# Altium project Yukitora.PrjPcb (part 1 of 2)
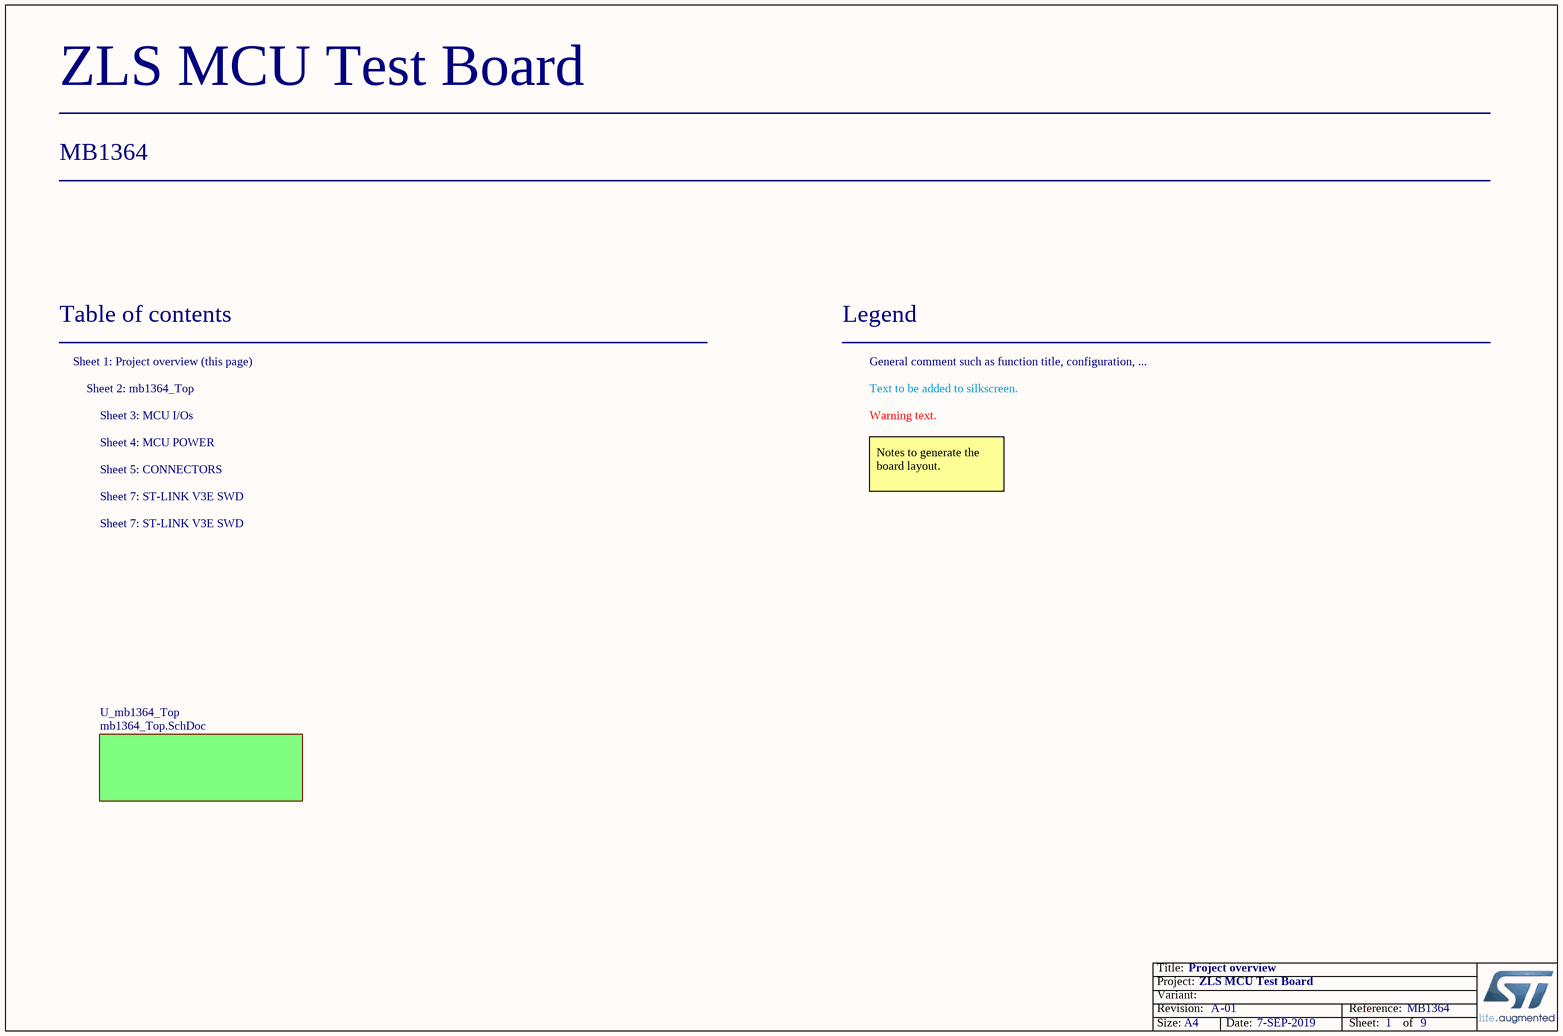
[diagram p0: Project_Overview.SchDoc]
Board_Assembly_Revision: 01; Board_Document_Date: 7-SEP-2019; Board_Name: ZLS MCU Test Board; Board_PCB_Revision: A; Board_Reference: MB1364
7 sheets, 64 parts. Net scope: flat (ports and power ports of the same name join across sheets).
Board file: MB1364.PcbDoc
Sheets:
  Project_Overview.SchDoc
    U_mb1364_Top = MB1364_Top.SchDoc
      U_Connectors = Connectors.SchDoc
      U_Power_Board = Power_Board.SchDoc
      U_MCU_144_IOs = MCU_144_IOs.SchDoc
      U_MCU_144_POWER = MCU_144_POWER.SchDoc
      U_ST_LINK_V3E = ST_LINK_V3E.SchDoc

## Sheet Project_Overview.SchDoc: Project overview
size A4; Date: Not used; ApprovedBy: Not used; CheckedBy: Not used; Author: Not used; CompanyName: STMicroelectronics; DrawnBy: Not used; Engineer: Not used; Organization: Not used; Address1: Not used; Address2: Not used; Address3: Not used; Address4: Not used; DocumentNumber: 1; Revision: Not used; SheetNumber: 1; SheetTotal: 9; CurrentTime: Not used; CurrentDate: Not used; Time: Not used; DocumentFullPathAndName: Not used; DocumentName: Not used; ModifiedDate: Not used; ImagePath: Not used; ProjectName: Not used; Application_BuildNumber: Not used

### Sub-sheets
U_mb1364_Top = mb1364_Top.SchDoc: no entries

### Notes on the sheet
- Table of contents
- Sheet 1: Project overview (this page)
- Legend
- General comment such as function title, configuration, ...
- Sheet 2: mb1364_Top
- Sheet 4: MCU POWER
- Sheet 3: MCU I/Os
- Text to be added to silkscreen.
- Warning text.
- Sheet 5: CONNECTORS
- Sheet 7: ST-LINK V3E SWD
- Notes to generate the board layout.
- Title:
- Project:
- Size:
- Revision:
- Variant:
- A4
- -
- Date:
- Reference:
- Sheet:
- of

## Sheet MB1364_Top.SchDoc: mb1319 Top: hierarchical view
size OrCAD A; Date: Not used; ApprovedBy: Not used; CheckedBy: Not used; Author: Not used; CompanyName: STMicroelectronics; DrawnBy: Not used; Engineer: Not used; Organization: Not used; Address1: Not used; Address2: Not used; Address3: Not used; Address4: Not used; DocumentNumber: 2; Revision: Not used; SheetNumber: 2; SheetTotal: 9; CurrentTime: Not used; CurrentDate: Not used; Time: Not used; DocumentFullPathAndName: Not used; DocumentName: Not used; ModifiedDate: Not used; ImagePath: Not used; ProjectName: Not used; Application_BuildNumber: Not used
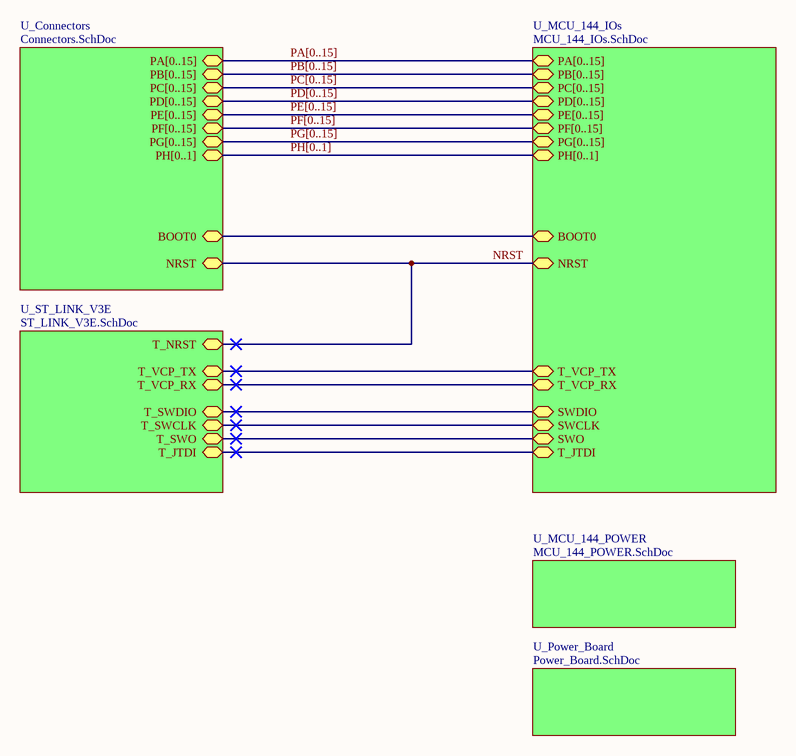
[diagram p1: MB1364_Top.SchDoc]

### Sub-sheets
U_Connectors = Connectors.SchDoc: PA[0..15] (bidir), PB[0..15] (bidir), PC[0..15] (bidir), PD[0..15] (bidir), PE[0..15] (bidir), PH[0..1] (bidir), NRST, BOOT0, PF[0..15] (bidir), PG[0..15] (bidir)
U_MCU_144_IOs = MCU_144_IOs.SchDoc: NRST (bidir), BOOT0 (bidir), SWO (bidir), SWCLK (bidir), SWDIO (bidir), T_VCP_TX (bidir), T_VCP_RX (bidir), PA[0..15] (bidir), PB[0..15] (bidir), PC[0..15] (bidir), PD[0..15] (bidir), PE[0..15] (bidir), PH[0..1] (bidir), T_JTDI (bidir), PG[0..15] (bidir), PF[0..15] (bidir)
U_MCU_144_POWER = MCU_144_POWER.SchDoc: no entries
U_Power_Board = Power_Board.SchDoc: no entries
U_ST_LINK_V3E = ST_LINK_V3E.SchDoc: T_NRST (bidir), T_SWDIO (bidir), T_VCP_TX (bidir), T_VCP_RX (bidir), T_SWCLK (bidir), T_SWO (bidir), T_JTDI (bidir)

### Nets
NRST: sheet U_Connectors/NRST, sheet U_MCU_144_IOs/NRST, sheet U_ST_LINK_V3E/T_NRST
(unnamed): sheet U_Connectors/BOOT0, sheet U_MCU_144_IOs/BOOT0
(unnamed): sheet U_MCU_144_IOs/SWO, sheet U_ST_LINK_V3E/T_SWO
(unnamed): sheet U_MCU_144_IOs/SWCLK, sheet U_ST_LINK_V3E/T_SWCLK
(unnamed): sheet U_MCU_144_IOs/SWDIO, sheet U_ST_LINK_V3E/T_SWDIO
(unnamed): sheet U_MCU_144_IOs/T_VCP_TX, sheet U_ST_LINK_V3E/T_VCP_TX
(unnamed): sheet U_MCU_144_IOs/T_VCP_RX, sheet U_ST_LINK_V3E/T_VCP_RX
(unnamed): sheet U_MCU_144_IOs/T_JTDI, sheet U_ST_LINK_V3E/T_JTDI

### Buses and harness runs
bus PA[0..15] = sheet U_Connectors/PA[0..15] = sheet U_MCU_144_IOs/PA[0..15]
bus PB[0..15] = sheet U_Connectors/PB[0..15] = sheet U_MCU_144_IOs/PB[0..15]
bus PC[0..15] = sheet U_Connectors/PC[0..15] = sheet U_MCU_144_IOs/PC[0..15]
bus PD[0..15] = sheet U_Connectors/PD[0..15] = sheet U_MCU_144_IOs/PD[0..15]
bus PE[0..15] = sheet U_Connectors/PE[0..15] = sheet U_MCU_144_IOs/PE[0..15]
bus PF[0..15] = sheet U_Connectors/PF[0..15] = sheet U_MCU_144_IOs/PF[0..15]
bus PG[0..15] = sheet U_Connectors/PG[0..15] = sheet U_MCU_144_IOs/PG[0..15]
bus PH[0..1] = sheet U_Connectors/PH[0..1] = sheet U_MCU_144_IOs/PH[0..1]

### Notes on the sheet
- Title
- Size:
- Date:
- Orcad A
- Number:
- Time:
- Revision:
- Sheet
- of
- ZLS Corporation
- 7801 North Lamar Blvd.
- Suite E-184
- Austin, Texas 78752  USA
- (512) 453-0288
- File:

## Sheet Connectors.SchDoc: Connectors
size Tabloid; Date: Not used; ApprovedBy: Not used; CheckedBy: Not used; Author: Not used; CompanyName: STMicroelectronics; DrawnBy: Not used; Engineer: Not used; Organization: Not used; Address1: Not used; Address2: Not used; Address3: Not used; Address4: Not used; DocumentNumber: 5; Revision: Not used; SheetNumber: 5; SheetTotal: 9; CurrentTime: Not used; CurrentDate: Not used; Time: Not used; DocumentFullPathAndName: Not used; DocumentName: Not used; ModifiedDate: Not used; ImagePath: Not used; ProjectName: Not used; Application_BuildNumber: Not used
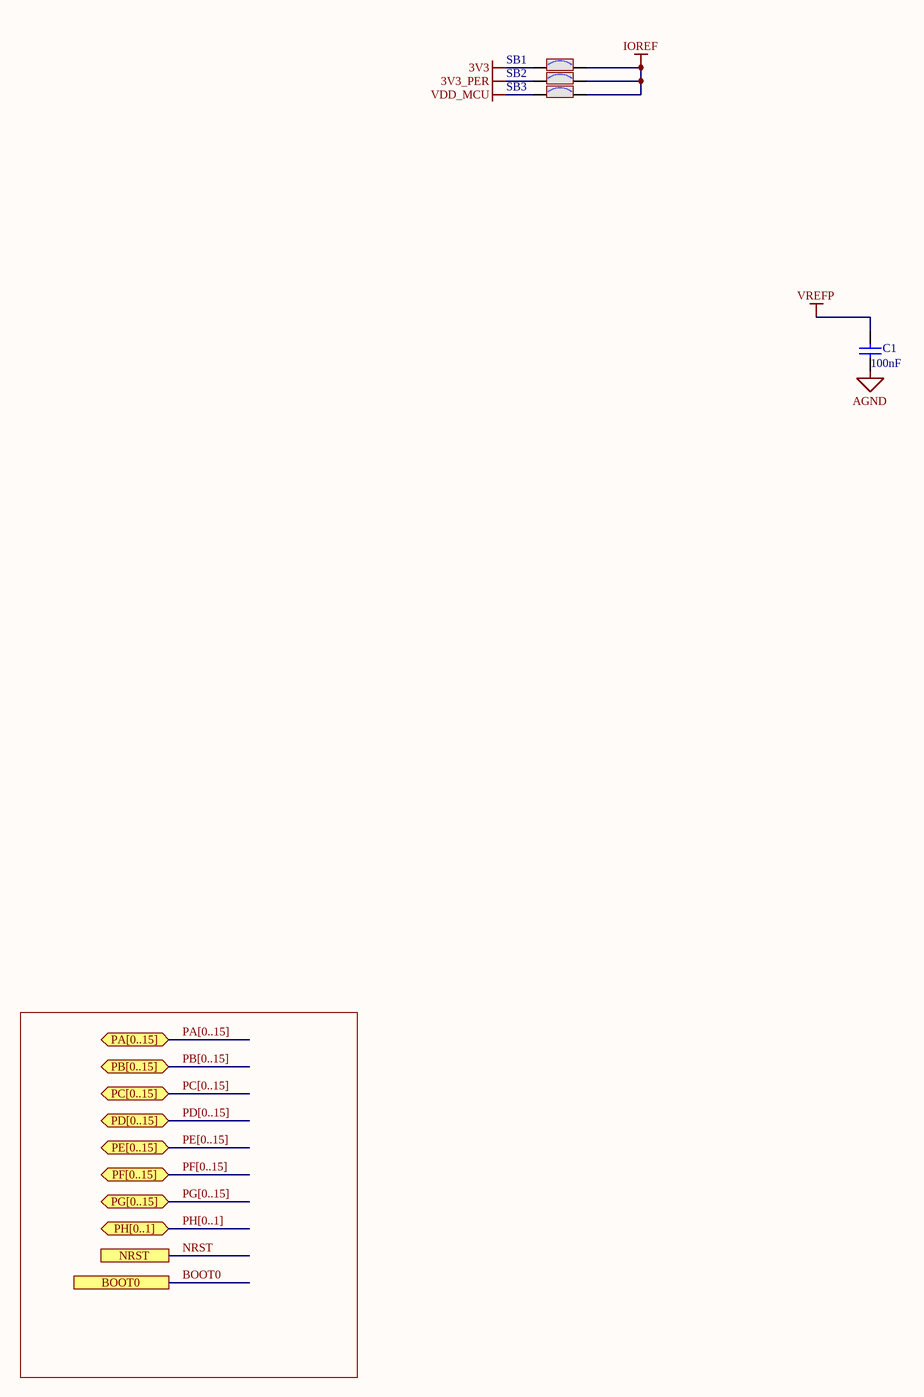
[diagram p2: Connectors.SchDoc]

### Parts
C1  Capacitance: 100nF  [C0402]  (hidden comment: Capacitor)
SB1  SB_ON  [SOLDER-BRIDGE_R0603-0R]  (value not drawn)
SB2  SB_ON  [SOLDER-BRIDGE_R0603-0R]  (value not drawn)
SB3  SB_ON  [SOLDER-BRIDGE_R0603-0R]  (value not drawn)

### Ports
BOOT0, NRST, PA[0..15] (bidir), PB[0..15] (bidir), PC[0..15] (bidir), PD[0..15] (bidir), PE[0..15] (bidir), PF[0..15] (bidir), PG[0..15] (bidir), PH[0..1] (bidir)

### Nets
3V3: SB1.1
3V3_PER: SB2.1
AGND: C1.1
IOREF: SB1.2 SB2.2 SB3.2
VDD_MCU: SB3.1
VREFP: C1.2

### Buses and harness runs
bus PA[0..15] = port PA[0..15]
bus PB[0..15] = port PB[0..15]
bus PC[0..15] = port PC[0..15]
bus PD[0..15] = port PD[0..15]
bus PE[0..15] = port PE[0..15]
bus PF[0..15] = port PF[0..15]
bus PG[0..15] = port PG[0..15]
bus PH[0..1] = port PH[0..1]

### Notes on the sheet
- Title
- Size:
- Date:
- Tabloid
- Number:
- Time:
- Revision:
- Sheet
- of
- ZLS Corporation
- 7801 North Lamar Blvd.
- Suite E-184
- Austin, Texas 78752  USA
- (512) 453-0288
- File:

### Library data of the parts
C1 = MCD-01123: CAP CER 0.1UF 16V X7R 0402; Manufacturer: Yageo; Manufacturer Part Number: CC0402KRX7R7BB104; Tolerance: 10%; Supplier 1: Mouser; Supplier Part Number 1: 603-CC402KRX7R7BB104; Stock 1: 164534511; Pricing 1: 1=0.10000, 10=0.02700, 50=0.02700, 100=0.01200, 1000=0.00700, 2500=0.00600, 10000=0.00500, 20000=0.00400 (USD); RoHS: Yes; Mount: Surface Mount; Case/Package: 0402; Number of Pins: 2; Case Code (Metric): 1005; Case Code (Imperial): 0402; Min Operating Temperature: -55°C; Max Operating Temperature: 125°C; Dielectric: X7R; Voltage Rating: 16V; Voltage Rating (DC): 16V; Packaging: Tape and Reel; Package Quantity: 1; Termination: SMD/SMT; Composition: Ceramic; Voltage: 16V; Length: 1mm; Height: 0.5mm; Width: 0.02inch; Thickness: 0.022inch; Depth: 0.5mm; Radiation Hardening: No; REACH SVHC: No SVHC; Lead Free: Lead Free; Halogen Free: Halogen Free; ComponentLink1URL: https://datasheet.ciiva.com/11788/0900766b80ce67ed-11788364.pdf?src-supplier=RSComponents; ComponentLink1Description: https://datasheet.ciiva.com/11788/0900766b80ce67ed-11788364.pdf?src-supplier=RSComponents; ComponentLink2URL: https://datasheet.ciiva.com/16625/upy-gphc-x7r-6-3v-to-50v-8-16625511.pdf?src-supplier=Avnet+Europe; ComponentLink2Description: https://datasheet.ciiva.com/16625/upy-gphc-x7r-6-3v-to-50v-8-16625511.pdf?src-supplier=Avnet+Europe; ComponentLink3URL: https://datasheet.ciiva.com/161/mlccorderingcode-161544.pdf?src-supplier=Digi-Key; ComponentLink3Description: https://datasheet.ciiva.com/161/mlccorderingcode-161544.pdf?src-supplier=Digi-Key; ComponentLink4URL: https://datasheet.ciiva.com/11587/upy-gphc-x7r-6-3v-to-50v-8-11587305.pdf?src-supplier=Avnet; ComponentLink4Description: https://datasheet.ciiva.com/11587/upy-gphc-x7r-6-3v-to-50v-8-11587305.pdf?src-supplier=Avnet; ComponentLink5URL: https://datasheet.ciiva.com/161/mlccorderingcode-161546.pdf?src-supplier=Digi-Key; ComponentLink5Description: https://datasheet.ciiva.com/161/mlccorderingcode-161546.pdf?src-supplier=Digi-Key; ComponentLink6URL: https://datasheet.ciiva.com/7978/1489800-7978111.pdf?src-supplier=Element14; ComponentLink6Description: https://datasheet.ciiva.com/7978/1489800-7978111.pdf?src-supplier=Element14; ComponentLink7URL: https://datasheet.ciiva.com/161/mlccorderingcode-161545.pdf?src-supplier=Digi-Key; ComponentLink7Description: https://datasheet.ciiva.com/161/mlccorderingcode-161545.pdf?src-supplier=Digi-Key; ComponentLink8URL: https://datasheet.ciiva.com/13395/upy-gphc-x7r-6-3v-to-50v-8-13395676.pdf?src-supplier=Mouser; ComponentLink8Description: https://datasheet.ciiva.com/13395/upy-gphc-x7r-6-3v-to-50v-8-13395676.pdf?src-supplier=Mouser; ComponentLink9URL: https://datasheet.ciiva.com/8033/1734573-8033661.pdf?src-supplier=Element14; ComponentLink9Description: https://datasheet.ciiva.com/8033/1734573-8033661.pdf?src-supplier=Element14; ComponentLink10URL: https://datasheet.ciiva.com/8033/1734573-8033663.pdf?src-supplier=Element14; ComponentLink10Description: https://datasheet.ciiva.com/8033/1734573-8033663.pdf?src-supplier=Element14; ComponentLink11URL: https://datasheet.ciiva.com/28450/1489800-28450335.pdf?src-supplier=Element14; ComponentLink11Description: https://datasheet.ciiva.com/28450/1489800-28450335.pdf?src-supplier=Element14
SB1-SB3 = MCD-00071: Solder Bridge ON; Part_Type: Mechanical; Manufacturer_Part_Number: RC0603JR-070RL; Manufacturer: YAGEO; Provided_By: SUBCO; Internal_Part_Number: MCD-00071; Status: Released; ComponentLink1Description: Datasheet; Package: SB0603; ComponentLink1URL: http://tunmcdsvn.tun.st.com/Component_Datasheet_Library/Trunk/Resistors/Yageo_Resistor_RC0603-series; ECCN_US: n/a; ECCN_EU: n/a

## Sheet Power_Board.SchDoc: MAIN POWER 5V / 3V3 / 1V8
size OrCAD A; Date: Not used; ApprovedBy: Not used; CheckedBy: Not used; Author: Not used; CompanyName: STMicroelectronics; DrawnBy: Not used; Engineer: Not used; Organization: Not used; Address1: Not used; Address2: Not used; Address3: Not used; Address4: Not used; DocumentNumber: 9; Revision: Not used; SheetNumber: 8; SheetTotal: 9; CurrentTime: Not used; CurrentDate: Not used; Time: Not used; DocumentFullPathAndName: Not used; DocumentName: Not used; ModifiedDate: Not used; ImagePath: Not used; ProjectName: Not used; Application_BuildNumber: Not used
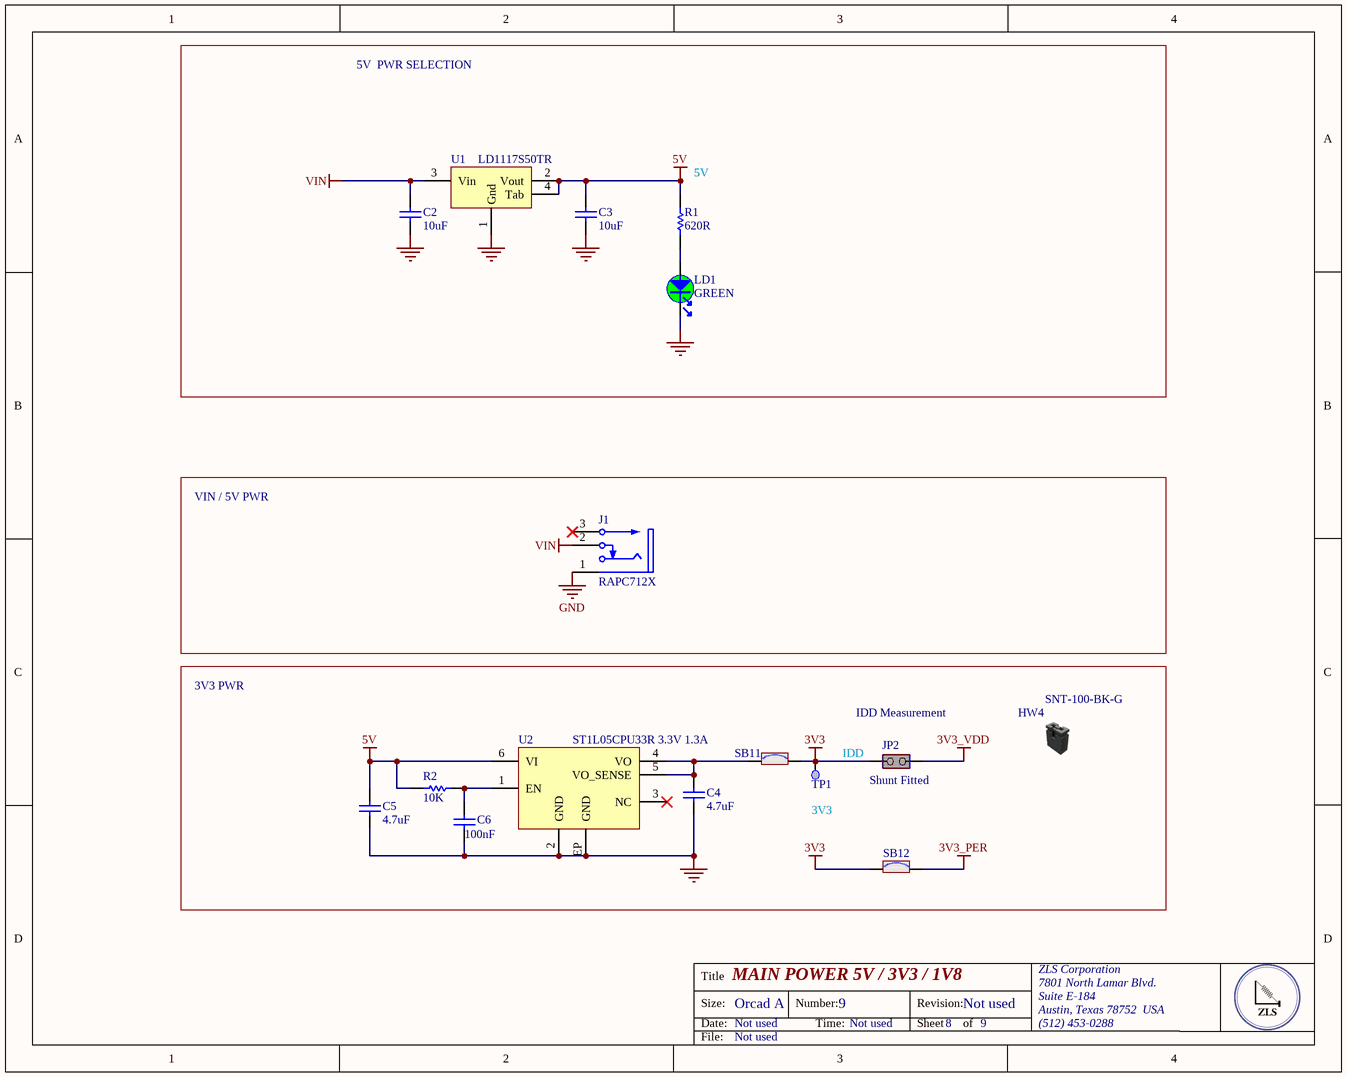
[diagram p3: Power_Board.SchDoc]

### Parts
C2  value 10uF  [C0805]  (hidden comment: Capacitor)
C3  value 10uF  [C0805]  (hidden comment: Capacitor)
C4  value 4.7uF  [C0603]  (hidden comment: Capacitor)
C5  value 4.7uF  [C0603]  (hidden comment: Capacitor)
C6  Capacitance: 100nF  [C0402]  (hidden comment: Capacitor)
HW4  value SNT-100-BK-G  (hidden comment: Shunt Black 2.54mm)  (mechanical)
J1  RAPC712X  [SWITCH-RAPC712X-3_V]
JP2  value Shunt Fitted  [CON_SAMTEC_TSW-102-07-G-S]  (hidden comment: Jumper_Header 2x1 Fitted)
LD1  value GREEN  [LED_0603_OSRAM_LG-Q396-PS-35_GREEN_1A2K_H0P4]  (hidden comment: LED_green)
R1  value 620R  [R0603]  (hidden comment: Resistor)
R2  value 10K  [R0402]  (hidden comment: Resistor)
SB11  SB_ON  [SOLDER-BRIDGE_R0603-0R]  (value not drawn)
SB12  SB_ON  [SOLDER-BRIDGE_R0603-0R]  (value not drawn)
TP1  Test Point  [TP_SMD_1MM]  (value not drawn)  (no BOM)
U1  LD1117S50TR  [REG_SOT223-TAB]
U2  value ST1L05CPU33R 3.3V 1.3A  [ICC_DFN6-EPAD_3X3_P095]  (hidden comment: ST1L05CPU33R)

### Blocks framed on the sheet
VIN / 5V PWR: J1

### Nets
3V3: JP2.1(COMMON) SB11.2 SB12.1 TP1.1
3V3_PER: SB12.2
3V3_VDD: JP2.2(NO)
5V: C3.2 C5.2 R1.2 R2.2 U1.2(Vout) U1.4(Tab) U2.6(VI)
GND: C2.1 C3.1 C4.1 C5.1 C6.1 J1.1 LD1.2 U1.1(Gnd) U2.2(GND) U2.EP(GND)
VIN: C2.2 J1.2 U1.3(Vin)
NetC4_2: C4.2 SB11.1 U2.4(VO) U2.5(VO_SENSE)
NetC6_2: C6.2 R2.1 U2.1(EN)
NetLD1_1: LD1.1 R1.1

Not connected (* = marked no-connect by the designer): J1 3*; U2 3(NC)*

### Notes on the sheet
- 5V  PWR SELECTION
- (near R1) 5V
- 3V3 PWR
- IDD
- (near JP2) IDD Measurement
- (near TP1) 3V3
- Title
- Size:
- Date:
- Orcad A
- Number:
- Time:
- Revision:
- Sheet
- of
- ZLS Corporation
- 7801 North Lamar Blvd.
- Suite E-184
- Austin, Texas 78752  USA
- (512) 453-0288
- File:

### Library data of the parts
C2 C3 = MCD-00014: Capacitor, MLCC, 10uF, 25V, X5R, 10%, 0805, T=0,85mm; Manufacturer_Part_Number: CC0805KRX5R8BB106; Manufacturer: YAGEO; Provided_By: SUBCO; ECCN_US: EAR99; ECCN_EU: NEC; Internal_Part_Number: MCD-00014; ComponentLink1Description: Datasheet; Status: Released; Part_Type: Capacitor; Package: C0805; ComponentLink1URL: http://tunmcdsvn.tun.st.com/Component_Datasheet_Library/Trunk/Capacitors/Yageo_Multilayer_capacitor_X5R_series_100pF_to_100uF
C4 = MCD-01121: Capacitor, MLCC, 4.7µF, 10V, X5R, 20%, 0603, T=0,8mm; Manufacturer_Part_Number: GRM188R61A475ME15; Manufacturer: MURATA; Provided_By: SUBCO; ECCN_US: EAR99; ECCN_EU: NEC; Internal_Part_Number: MCD-01121; Status: Released; Part_Type: Capacitor; Package: C0603; ComponentLink1Description: Datasheet; ComponentLink1URL: http://tunmcdsvn.tun.st.com/Component_Datasheet_Library/Trunk/Capacitors/Murata_Capacitor_GR_series
C5 = MCD-00097: Capacitor, MLCC, 4.7uF, 16V, X5R, 20%, 0603, T=0,8mm; Manufacturer_Part_Number: GRM188R61C475KE11; Manufacturer: MURATA; Alternate_Manufacturer_Part_Number: GRM188R61C475MAAJ; Provided_By: SUBCO; ECCN_US: EAR99; ECCN_EU: NEC; Internal_Part_Number: MCD-00097; Status: Released; Part_Type: Capacitor; Package: C0603; ComponentLink1Description: Datasheet; ComponentLink1URL: http://tunmcdsvn.tun.st.com/Component_Datasheet_Library/Trunk/Capacitors/Murata_Capacitor_GR_series; Alternate_Manufacturer: Murata
C6 = MCD-01123: as C1 on sheet Connectors; Supplier 1: Mouser; Supplier Part Number 1: 603-CC402KRX7R7BB104; Stock 1: 164534511; Pricing 1: 1=0.10000, 10=0.02700, 50=0.02700, 100=0.01200, 1000=0.00700, 2500=0.00600, 10000=0.00500, 20000=0.00400 (USD); RoHS: Yes; Mount: Surface Mount; Case/Package: 0402; Number of Pins: 2; Case Code (Metric): 1005; Case Code (Imperial): 0402; Min Operating Temperature: -55°C; Max Operating Temperature: 125°C; Dielectric: X7R; Voltage Rating: 16V; Voltage Rating (DC): 16V; Packaging: Tape and Reel; Package Quantity: 1; Termination: SMD/SMT; Composition: Ceramic; Voltage: 16V; Length: 1mm; Height: 0.5mm; Width: 0.02inch; Thickness: 0.022inch; Depth: 0.5mm; Radiation Hardening: No; REACH SVHC: No SVHC; Lead Free: Lead Free; Halogen Free: Halogen Free; ComponentLink1URL: https://datasheet.ciiva.com/11788/0900766b80ce67ed-11788364.pdf?src-supplier=RSComponents; ComponentLink1Description: https://datasheet.ciiva.com/11788/0900766b80ce67ed-11788364.pdf?src-supplier=RSComponents; ComponentLink2URL: https://datasheet.ciiva.com/16625/upy-gphc-x7r-6-3v-to-50v-8-16625511.pdf?src-supplier=Avnet+Europe; ComponentLink2Description: https://datasheet.ciiva.com/16625/upy-gphc-x7r-6-3v-to-50v-8-16625511.pdf?src-supplier=Avnet+Europe; ComponentLink3URL: https://datasheet.ciiva.com/161/mlccorderingcode-161544.pdf?src-supplier=Digi-Key; ComponentLink3Description: https://datasheet.ciiva.com/161/mlccorderingcode-161544.pdf?src-supplier=Digi-Key; ComponentLink4URL: https://datasheet.ciiva.com/11587/upy-gphc-x7r-6-3v-to-50v-8-11587305.pdf?src-supplier=Avnet; ComponentLink4Description: https://datasheet.ciiva.com/11587/upy-gphc-x7r-6-3v-to-50v-8-11587305.pdf?src-supplier=Avnet; ComponentLink5URL: https://datasheet.ciiva.com/161/mlccorderingcode-161546.pdf?src-supplier=Digi-Key; ComponentLink5Description: https://datasheet.ciiva.com/161/mlccorderingcode-161546.pdf?src-supplier=Digi-Key; ComponentLink6URL: https://datasheet.ciiva.com/7978/1489800-7978111.pdf?src-supplier=Element14; ComponentLink6Description: https://datasheet.ciiva.com/7978/1489800-7978111.pdf?src-supplier=Element14; ComponentLink7URL: https://datasheet.ciiva.com/161/mlccorderingcode-161545.pdf?src-supplier=Digi-Key; ComponentLink7Description: https://datasheet.ciiva.com/161/mlccorderingcode-161545.pdf?src-supplier=Digi-Key; ComponentLink8URL: https://datasheet.ciiva.com/13395/upy-gphc-x7r-6-3v-to-50v-8-13395676.pdf?src-supplier=Mouser; ComponentLink8Description: https://datasheet.ciiva.com/13395/upy-gphc-x7r-6-3v-to-50v-8-13395676.pdf?src-supplier=Mouser; ComponentLink9URL: https://datasheet.ciiva.com/8033/1734573-8033661.pdf?src-supplier=Element14; ComponentLink9Description: https://datasheet.ciiva.com/8033/1734573-8033661.pdf?src-supplier=Element14; ComponentLink10URL: https://datasheet.ciiva.com/8033/1734573-8033663.pdf?src-supplier=Element14; ComponentLink10Description: https://datasheet.ciiva.com/8033/1734573-8033663.pdf?src-supplier=Element14; ComponentLink11URL: https://datasheet.ciiva.com/28450/1489800-28450335.pdf?src-supplier=Element14; ComponentLink11Description: https://datasheet.ciiva.com/28450/1489800-28450335.pdf?src-supplier=Element14
HW4 = MCD-00043: SHUNT 2.54mm BLACK; Manufacturer: SAMTEC; Part_Type: Mechanical; Alternate_Manufacturer_Part_Number: 316102S111A; Alternate_Manufacturer: JIUBABA; Provided_By: SUBCO; Internal_Part_Number: MCD-00043; Manufacturer_Part_Number: SNT-100-BK-G; ComponentLink1Description: Datasheet; Status: Released; ComponentLink1URL: http://tunmcdsvn.tun.st.com/Component_Datasheet_Library/Trunk/Connectors/Samtec_Shunt_Jumper_SNT100; ECCN_US: n/a; ECCN_EU: n/a
J1 = CMP-2000-05383-1: Conn Powerjack Mini R/A PCMT, 5 A, 3-Pin THD, RoHS; Manufacturer: Switchcraft; Gender: Male; Current Rating: 5A; Connector Type: Jack; Dynamic Catalog: SwitchcraftInc; Other Names: Q2387461 / Q2526383 / RAPC712X-ND / SC237; Internal Switch(s): SingleSwitch,NormallyClosed; Catalog Drawings: RAPC7(1,2)2XSide / RAPC7(1,2)2XTop; Plug/Mating Plug Diameter: 2.5mmID,5.5mmOD; Number of Positions/Contacts: 2Conductors,2Contacts; Shielding: Unshielded; Mating Products: SC1539-ND / -CONNPLUGMINIPWR2CONDBLK/RED / SC1051-ND / -CONNPLUGMINIPOWER2CONDBLACK; Mounting Type: ThroughHole,RightAngle; Manufacturer URL: http://www.switchcraft.com/; Contact Material: Brass; Standard Package: 2,500; RoHS Information: SwitchcraftRoHSInfo; Termination: SolderEyelet(s); Housing Color: Black; Datasheet Version: Rev. A, 08/2005; Family: Barrel-PowerConnectors; Housing Material: Thermoplastic; Color: Black; Datasheet URL: https://datasheet.ciiva.com/391/rapc712x-cd-391666.pdf; Category: Connectors,Interconnects; Contact Material - Plating: Nickel
JP2 = MCD-00683: Header, 2x1, 2,54mm, VR, TH, Height 5.84mm/2.54mm - Shunt Fitted by default; Part_Type: Connector; Manufacturer_Part_Number: TSW-102-07-x-S; Manufacturer: SAMTEC; Alternate_Manufacturer_Part_Number: 313102S111116; Alternate_Manufacturer: LIANYI; Provided_By: SUBCO; Internal_Part_Number: MCD-00683; Status: Released; ComponentLink1Description: Datasheet; ComponentLink1URL: http://tunmcdsvn.tun.st.com/Component_Datasheet_Library/Trunk/Connectors/Samtec_TSW-HTSW-series; ECCN_US: n/a; ECCN_EU: n/a
LD1 = MCD-00588: LED Green, 0603 SMD, Forward Voltage Typ=2V, Max=2.5V; Part_Type: Display; Manufacturer_Part_Number: LG Q396-PS-35; Manufacturer: OSRAM OPTO SEMICONDUCTORS; Alternate_Manufacturer_Part_Number: VLMTG1300-GS08; Alternate_Manufacturer: VISHAY SEMICONDUCTOR OPTO DIVISION; Provided_By: SUBCO; Internal_Part_Number: MCD-00588; Status: Released; Package: LED 0603; ComponentLink1Description: Datasheet; ComponentLink1URL: http://tunmcdsvn.tun.st.com/Component_Datasheet_Library/Trunk/Display/OSRAM_LED_GREEN_LG Q396-PS-35; Order_Code_Digikey: LG Q396-PS-35-ND; ECCN_US: n/a; ECCN_EU: n/a
R1 = MCD-00500: Resistor,620R,0603,1%,1/10W; Manufacturer_Part_Number: RC0603FR-07620RL; Manufacturer: YAGEO; Provided_By: SUBCO; ECCN_US: EAR99; ECCN_EU: NEC; Internal_Part_Number: MCD-00500; Status: Released; Part_Type: Resistor; Package: R0603; ComponentLink1Description: Datasheet; ComponentLink1URL: http://tunmcdsvn.tun.st.com/Component_Datasheet_Library/Trunk/Resistors/Yageo_Resistor_RC0603-series
R2 = MCD-00053: Resistor,10K,0402,1%,1/16W; Manufacturer_Part_Number: RC0402FR-0710KL; Manufacturer: YAGEO; Provided_By: SUBCO; ECCN_US: EAR99; ECCN_EU: NEC; Internal_Part_Number: MCD-00053; Status: Released; ComponentLink1Description: Datasheet; Part_Type: Resistor; Package: R0402; ComponentLink1URL: http://tunmcdsvn.tun.st.com/Component_Datasheet_Library/Trunk/Resistors/Yageo_Resistor_RC0402-series
SB11 SB12 = MCD-00071: as SB1 on sheet Connectors; Internal_Part_Number: MCD-00071; Status: Released; ComponentLink1Description: Datasheet; Package: SB0603; ComponentLink1URL: http://tunmcdsvn.tun.st.com/Component_Datasheet_Library/Trunk/Resistors/Yageo_Resistor_RC0603-series; ECCN_US: n/a; ECCN_EU: n/a
TP1 = MCD-00074: Test Point 1mm; Part_Type: Mechanical; Internal_Part_Number: MCD-00074; Provided_By: n/a; Status: Released; ComponentLink1Description: Datasheet; ComponentLink1URL: http://na; Manufacturer: n/a; Manufacturer_Part_Number: n/a; ECCN_US: n/a; ECCN_EU: n/a
U1 = MCD-00088: IC REG LDO 5V 0.8A SOT223; Manufacturer: STMICROELECTRONICS; BMS_Part_Number: 9176133; Provided_By: SUBCO with ST control; ECCN_US: EAR99; ECCN_EU: NEC; Value: LD1117S50TR; Internal_Part_Number: MCD-00088; Manufacturer_Part_Number: LD1117S50TR; ComponentLink1Description: Datasheet; Status: Released; Part_Type: IC; ComponentLink1URL: http://tunmcdsvn.tun.st.com/Component_Datasheet_Library/Trunk/IC/STM_LDO_LD1117; Package: SOT-223
U2 = MCD-01025: LDO, 3.3V, 1.3A, Very low quiescent current BiCMOS voltage regulator; Part_Type: IC; Manufacturer: STMICROELECTRONICS; BMS_Part_Number: 9176246; Provided_By: SUBCO with ST control; ECCN_US: EAR99; ECCN_EU: NEC; Internal_Part_Number: MCD-01025; Status: Released; Manufacturer_Part_Number: ST1L05CPU33R; Package: DFN6-3x3; ComponentLink1Description: Datasheet; ComponentLink1URL: http://tunmcdsvn.tun.st.com/Component_Datasheet_Library/Trunk/IC/STM_LDO_ST1L05CPU33R

## Sheet MCU_144_IOs.SchDoc: MCU 144 I/Os
size Tabloid; Date: Not used; ApprovedBy: Not used; CheckedBy: Not used; Author: Not used; CompanyName: STMicroelectronics; DrawnBy: Not used; Engineer: Not used; Organization: Not used; Address1: Not used; Address2: Not used; Address3: Not used; Address4: Not used; DocumentNumber: 3; Revision: Not used; SheetNumber: 3; SheetTotal: 9; CurrentTime: Not used; CurrentDate: Not used; Time: Not used; DocumentFullPathAndName: Not used; DocumentName: Not used; ModifiedDate: Not used; ImagePath: Not used; ProjectName: Not used; Application_BuildNumber: Not used
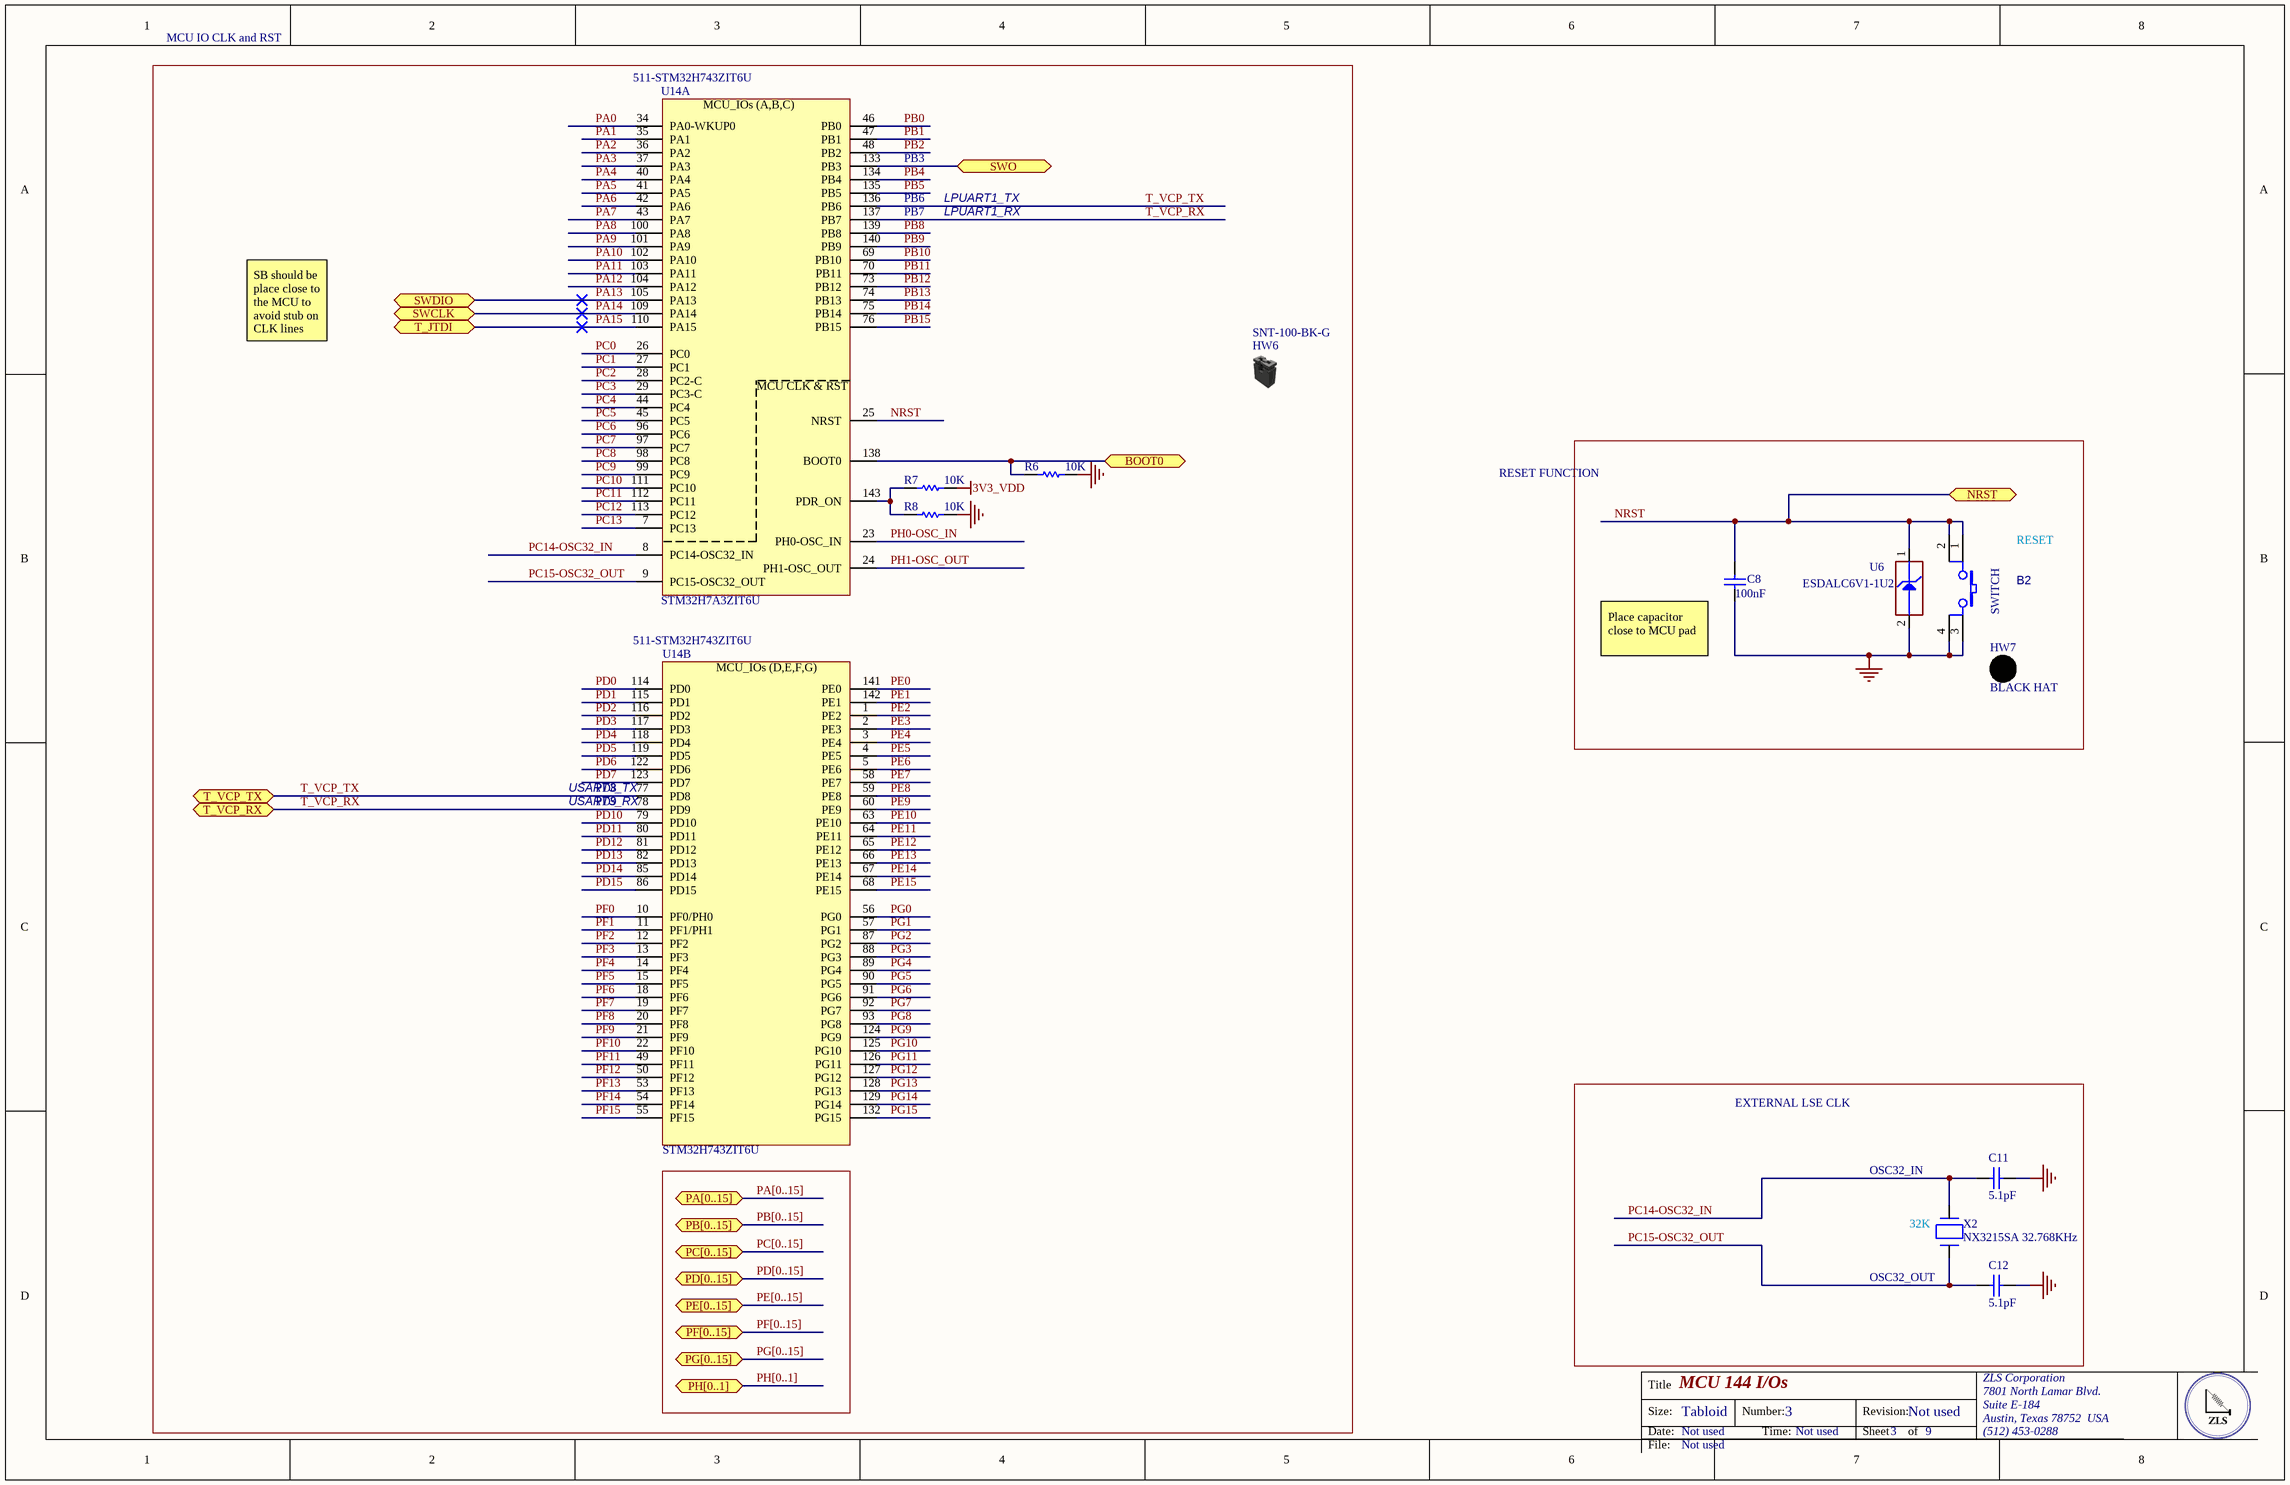
[diagram p4: MCU_144_IOs.SchDoc]

### Parts
B2  value SWITCH  [SWI_WEALTHMETAL_TD-0341_4P_BLACK]  (hidden comment: SW-PUSH-CMS)
C8  Capacitance: 100nF  [C0402]  (hidden comment: Capacitor)
C11  value 5.1pF  [C0402]  (hidden comment: Do Not Place)
C12  value 5.1pF  [C0402]  (hidden comment: Do Not Place)
HW6  value SNT-100-BK-G  (hidden comment: Shunt Black 2.54mm)  (mechanical)
HW7  value BLACK HAT  (hidden comment: BUTTON_HAT_BLACK)  (mechanical)
R6  value 10K  [R0603]  (hidden comment: Resistor)
R7  value 10K  [R0603]  (hidden comment: Resistor)
R8  value 10K  [R0603]  (hidden comment: Resistor)
U6  value ESDALC6V1-1U2  [ESD_ST0201]  (hidden comment: ESD-TRANSIL)
U14  value STM32H7A3ZIT6U  Supplier Part Number 1: 511-STM32H743ZIT6U  [ICC_LQFP144_20X20_P050_SOCKET_YAMAICHI_IC149-144-145-B5_NM]  (hidden comment: STM32H7A3ZIT6)  (parts A,B of 3)
X2  value NX3215SA 32.768KHz  [CRY_NX3215SA_2P]  (hidden comment: XTAL_2_PINS)

### Ports
BOOT0 (bidir), NRST (bidir), PA[0..15] (bidir), PB[0..15] (bidir), PC[0..15] (bidir), PD[0..15] (bidir), PE[0..15] (bidir), PF[0..15] (bidir), PG[0..15] (bidir), PH[0..1] (bidir), SWCLK (bidir), SWDIO (bidir), SWO (bidir), T_JTDI (bidir), T_VCP_RX (bidir), T_VCP_TX (bidir)

### Nets
3V3_VDD: R7.2
GND: B2.3 B2.4 C8.1 C11.2 C12.2 R6.2 R8.2 U6.2(GND)
BOOT0: R6.1 U14.138(BOOT0) ; port BOOT0
NRST: B2.1 B2.2 C8.2 U6.1(IO1) U14.25(NRST) ; port NRST
PA0: U14.34(PA0-WKUP0)
PA1: U14.35(PA1)
PA2: U14.36(PA2)
PA3: U14.37(PA3)
PA4: U14.40(PA4)
PA5: U14.41(PA5)
PA6: U14.42(PA6)
PA7: U14.43(PA7)
PA8: U14.100(PA8)
PA9: U14.101(PA9)
PA10: U14.102(PA10)
PA11: U14.103(PA11)
PA12: U14.104(PA12)
PA13: U14.105(PA13) ; port SWDIO
PA14: U14.109(PA14) ; port SWCLK
PA15: U14.110(PA15) ; port T_JTDI
PB0: U14.46(PB0)
PB1: U14.47(PB1)
PB2: U14.48(PB2)
PB4: U14.134(PB4)
PB5: U14.135(PB5)
PB8: U14.139(PB8)
PB9: U14.140(PB9)
PB10: U14.69(PB10)
PB11: U14.70(PB11)
PB12: U14.73(PB12)
PB13: U14.74(PB13)
PB14: U14.75(PB14)
PB15: U14.76(PB15)
PC0: U14.26(PC0)
PC1: U14.27(PC1)
PC2: U14.28(PC2-C)
PC3: U14.29(PC3-C)
PC4: U14.44(PC4)
PC5: U14.45(PC5)
PC6: U14.96(PC6)
PC7: U14.97(PC7)
PC8: U14.98(PC8)
PC9: U14.99(PC9)
PC10: U14.111(PC10)
PC11: U14.112(PC11)
PC12: U14.113(PC12)
PC13: U14.7(PC13)
PC14-OSC32_IN: C11.1 U14.8(PC14-OSC32_IN) X2.2(X2)
PC15-OSC32_OUT: C12.1 U14.9(PC15-OSC32_OUT) X2.1(X1)
PD0: U14.114(PD0)
PD1: U14.115(PD1)
PD2: U14.116(PD2)
PD3: U14.117(PD3)
PD4: U14.118(PD4)
PD5: U14.119(PD5)
PD6: U14.122(PD6)
PD7: U14.123(PD7)
PD10: U14.79(PD10)
PD11: U14.80(PD11)
PD12: U14.81(PD12)
PD13: U14.82(PD13)
PD14: U14.85(PD14)
PD15: U14.86(PD15)
PE0: U14.141(PE0)
PE1: U14.142(PE1)
PE2: U14.1(PE2)
PE3: U14.2(PE3)
PE4: U14.3(PE4)
PE5: U14.4(PE5)
PE6: U14.5(PE6)
PE7: U14.58(PE7)
PE8: U14.59(PE8)
PE9: U14.60(PE9)
PE10: U14.63(PE10)
PE11: U14.64(PE11)
PE12: U14.65(PE12)
PE13: U14.66(PE13)
PE14: U14.67(PE14)
PE15: U14.68(PE15)
PF0: U14.10(PF0/PH0)
PF1: U14.11(PF1/PH1)
PF2: U14.12(PF2)
PF3: U14.13(PF3)
PF4: U14.14(PF4)
PF5: U14.15(PF5)
PF6: U14.18(PF6)
PF7: U14.19(PF7)
PF8: U14.20(PF8)
PF9: U14.21(PF9)
PF10: U14.22(PF10)
PF11: U14.49(PF11)
PF12: U14.50(PF12)
PF13: U14.53(PF13)
PF14: U14.54(PF14)
PF15: U14.55(PF15)
PG0: U14.56(PG0)
PG1: U14.57(PG1)
PG2: U14.87(PG2)
PG3: U14.88(PG3)
PG4: U14.89(PG4)
PG5: U14.90(PG5)
PG6: U14.91(PG6)
PG7: U14.92(PG7)
PG8: U14.93(PG8)
PG9: U14.124(PG9)
PG10: U14.125(PG10)
PG11: U14.126(PG11)
PG12: U14.127(PG12)
PG13: U14.128(PG13)
PG14: U14.129(PG14)
PG15: U14.132(PG15)
PH0-OSC_IN: U14.23(PH0-OSC_IN)
PH1-OSC_OUT: U14.24(PH1-OSC_OUT)
SWO: U14.133(PB3) ; port SWO
T_VCP_RX: U14.78(PD9) U14.137(PB7) ; port T_VCP_RX
T_VCP_TX: U14.77(PD8) U14.136(PB6) ; port T_VCP_TX
NetR7_1: R7.1 R8.1 U14.143(PDR_ON)

### Buses and harness runs
bus PA[0..15] = port PA[0..15]
bus PB[0..15] = port PB[0..15]
bus PC[0..15] = port PC[0..15]
bus PD[0..15] = port PD[0..15]
bus PE[0..15] = port PE[0..15]
bus PF[0..15] = port PF[0..15]
bus PG[0..15] = port PG[0..15]
bus PH[0..1] = port PH[0..1]

### Notes on the sheet
- MCU IO CLK and RST
- PB3
- PB6
- PB7
- LPUART1_TX
- LPUART1_RX
- SB should be place close to the MCU to avoid stub on CLK lines
- RESET FUNCTION
- RESET
- (near C8) Place capacitor close to MCU pad
- USART3_TX
- USART3_RX
- (near U14) PD8
- (near U14) PD9
- EXTERNAL LSE CLK
- OSC32_IN
- (near X2) 32K
- (near X2) OSC32_OUT
- Title
- Size:
- Date:
- Tabloid
- Number:
- Time:
- Revision:
- Sheet
- of
- ZLS Corporation
- 7801 North Lamar Blvd.
- Suite E-184
- Austin, Texas 78752  USA
- (512) 453-0288
- File:
- (in symbol MCD-01349, part A) MCU_IOs (A,B,C); MCU CLK & RST
- (in symbol MCD-01349, part B) MCU_IOs (D,E,F,G)
- (in symbol STM32H743ZIT6, part B) PB/PC
- (in symbol STM32H743ZIT6, part C) PD/PE
- (in symbol STM32H743ZIT6, part D) PF/PG

### Library data of the parts
B2 = MCD-00001: Non-Open Push-Button 0.1A 24V BLACK; Manufacturer_Part_Number: TD-0341; Manufacturer: WEALTHMETAL; Part_Type: Misc; Provided_By: SUBCO; Internal_Part_Number: MCD-00001; ComponentLink1Description: Datasheet; Status: Released; ComponentLink1URL: http://tunmcdsvn.tun.st.com/Component_Datasheet_Library/Trunk/Misc/Wealthmetal_Tact-Switch_TD0341; ECCN_US: n/a; ECCN_EU: n/a
C8 = MCD-01123: as C1 on sheet Connectors; Supplier 1: Mouser; Supplier Part Number 1: 603-CC402KRX7R7BB104; Stock 1: 164534511; Pricing 1: 1=0.10000, 10=0.02700, 50=0.02700, 100=0.01200, 1000=0.00700, 2500=0.00600, 10000=0.00500, 20000=0.00400 (USD); RoHS: Yes; Mount: Surface Mount; Case/Package: 0402; Number of Pins: 2; Case Code (Metric): 1005; Case Code (Imperial): 0402; Min Operating Temperature: -55°C; Max Operating Temperature: 125°C; Dielectric: X7R; Voltage Rating: 16V; Voltage Rating (DC): 16V; Packaging: Tape and Reel; Package Quantity: 1; Termination: SMD/SMT; Composition: Ceramic; Voltage: 16V; Length: 1mm; Height: 0.5mm; Width: 0.02inch; Thickness: 0.022inch; Depth: 0.5mm; Radiation Hardening: No; REACH SVHC: No SVHC; Lead Free: Lead Free; Halogen Free: Halogen Free; ComponentLink1URL: https://datasheet.ciiva.com/11788/0900766b80ce67ed-11788364.pdf?src-supplier=RSComponents; ComponentLink1Description: https://datasheet.ciiva.com/11788/0900766b80ce67ed-11788364.pdf?src-supplier=RSComponents; ComponentLink2URL: https://datasheet.ciiva.com/16625/upy-gphc-x7r-6-3v-to-50v-8-16625511.pdf?src-supplier=Avnet+Europe; ComponentLink2Description: https://datasheet.ciiva.com/16625/upy-gphc-x7r-6-3v-to-50v-8-16625511.pdf?src-supplier=Avnet+Europe; ComponentLink3URL: https://datasheet.ciiva.com/161/mlccorderingcode-161544.pdf?src-supplier=Digi-Key; ComponentLink3Description: https://datasheet.ciiva.com/161/mlccorderingcode-161544.pdf?src-supplier=Digi-Key; ComponentLink4URL: https://datasheet.ciiva.com/11587/upy-gphc-x7r-6-3v-to-50v-8-11587305.pdf?src-supplier=Avnet; ComponentLink4Description: https://datasheet.ciiva.com/11587/upy-gphc-x7r-6-3v-to-50v-8-11587305.pdf?src-supplier=Avnet; ComponentLink5URL: https://datasheet.ciiva.com/161/mlccorderingcode-161546.pdf?src-supplier=Digi-Key; ComponentLink5Description: https://datasheet.ciiva.com/161/mlccorderingcode-161546.pdf?src-supplier=Digi-Key; ComponentLink6URL: https://datasheet.ciiva.com/7978/1489800-7978111.pdf?src-supplier=Element14; ComponentLink6Description: https://datasheet.ciiva.com/7978/1489800-7978111.pdf?src-supplier=Element14; ComponentLink7URL: https://datasheet.ciiva.com/161/mlccorderingcode-161545.pdf?src-supplier=Digi-Key; ComponentLink7Description: https://datasheet.ciiva.com/161/mlccorderingcode-161545.pdf?src-supplier=Digi-Key; ComponentLink8URL: https://datasheet.ciiva.com/13395/upy-gphc-x7r-6-3v-to-50v-8-13395676.pdf?src-supplier=Mouser; ComponentLink8Description: https://datasheet.ciiva.com/13395/upy-gphc-x7r-6-3v-to-50v-8-13395676.pdf?src-supplier=Mouser; ComponentLink9URL: https://datasheet.ciiva.com/8033/1734573-8033661.pdf?src-supplier=Element14; ComponentLink9Description: https://datasheet.ciiva.com/8033/1734573-8033661.pdf?src-supplier=Element14; ComponentLink10URL: https://datasheet.ciiva.com/8033/1734573-8033663.pdf?src-supplier=Element14; ComponentLink10Description: https://datasheet.ciiva.com/8033/1734573-8033663.pdf?src-supplier=Element14; ComponentLink11URL: https://datasheet.ciiva.com/28450/1489800-28450335.pdf?src-supplier=Element14; ComponentLink11Description: https://datasheet.ciiva.com/28450/1489800-28450335.pdf?src-supplier=Element14
C11 C12 = MCD-00003: Capacitor, MLCC, 5.1pF, 50V, NPO, +-0.25pF, 0402, T=0.5mm; Manufacturer_Part_Number: CC0402CRNPO9BN5R1; Manufacturer: YAGEO; Provided_By: SUBCO; ECCN_US: EAR99; ECCN_EU: NEC; Internal_Part_Number: MCD-00003; ComponentLink1Description: Datasheet; Status: Released; Part_Type: Capacitor; Package: C0402; ComponentLink1URL: http://tunmcdsvn.tun.st.com/Component_Datasheet_Library/Trunk/Capacitors/Yageo_Capacitor_NP0_16V-to-50V
HW6 = MCD-00043: as HW4 on sheet Power_Board; Internal_Part_Number: MCD-00043; Manufacturer_Part_Number: SNT-100-BK-G; ComponentLink1Description: Datasheet; Status: Released; ComponentLink1URL: http://tunmcdsvn.tun.st.com/Component_Datasheet_Library/Trunk/Connectors/Samtec_Shunt_Jumper_SNT100; ECCN_US: n/a; ECCN_EU: n/a
HW7 = MCD-00635: Black Hat for switch TD0341X-G01-BLA; Part_Type: Mechanical; Manufacturer_Part_Number: 988.16.09.3.00003_SH-517; Manufacturer: JIUBABA; Provided_By: SUBCO; Internal_Part_Number: MCD-00635; Status: Released; ComponentLink1Description: Datasheet; ComponentLink1URL: http://tunmcdsvn.tun.st.com/Component_Datasheet_Library/Trunk/Mechanical/Jiubaba_HAT_SH-517; ECCN_US: n/a; ECCN_EU: n/a
R6-R8 = MCD-00220: Resistor,10K,0603,1%,1/10W; Manufacturer_Part_Number: RC0603FR-0710KL; Manufacturer: YAGEO; Provided_By: SUBCO; ECCN_US: EAR99; ECCN_EU: NEC; Internal_Part_Number: MCD-00220; Status: Released; Part_Type: Resistor; ComponentLink1Description: Datasheet; Package: R0603; ComponentLink1URL: http://tunmcdsvn.tun.st.com/Component_Datasheet_Library/Trunk/Resistors/Yageo_Resistor_RC0603-series
U6 = MCD-00170: ESD protection 6V1; Part_Type: Diode; Manufacturer: STMICROELECTRONICS; BMS_Part_Number: 9151132; Provided_By: SUBCO with ST control; ECCN_US: EAR99; ECCN_EU: NEC; Internal_Part_Number: MCD-00170; Status: Released; Manufacturer_Part_Number: ESDALC6V1-1U2; ComponentLink1Description: Datasheet; ComponentLink1URL: http://tunmcdsvn.tun.st.com/Component_Datasheet_Library/Trunk/Diodes/STM_ESD_ESDALC6V1-1U2
U14 = MCD-01349: STM32H7A3ZIT6U, LQFP144 package, 20x20; Part_Type: IC; Manufacturer: STMICROELECTRONICS; BMS_Part_Number: 9175347; Manufacturer Part Number: STM32H743ZIT6U; Provided_By: SUBCO with ST control; ECCN_US: 3A991A2; ECCN_EU: NEC; Internal_Part_Number: MCD-01349; Status: Released; Manufacturer_Part_Number: STM32H7A3ZIT6U; Package: LQFP144; ComponentLink1Description: Datasheet; ComponentLink1URL: http://tunmcdsvn.tun.st.com/Component_Datasheet_Library/Trunk/IC/STM_STM32L552ZET6QU; Supplier 1: Mouser; Stock 1: 24; Pricing 1: 1=13.41000, 10=12.33000, 25=11.82000, 50=11.82000, 100=10.41000, 250=9.90000, 500=9.26000, 1000=8.50000, 2500=7.68000, 10000=9.26000 (USD); RoHS: No
X2 = MCD-00091: Crystal 32.768kHz, 6pF, +-20ppm, 50Kohms max, SMD; Manufacturer_Part_Number: NX3215SA 32.768KHz EXS00A-MU00525; Manufacturer: NDK; Part_Type: Crystal_Osc; BMS_Part_Number: 9157034; Provided_By: SUBCO; ECCN_US: EAR99; ECCN_EU: NEC; Internal_Part_Number: MCD-00091; ComponentLink1Description: Datasheet; Status: Released; ComponentLink1URL: http://tunmcdsvn.tun.st.com/Component_Datasheet_Library/Trunk/Crystal_Osc/NDK_Crystal-For-ST_NX3215SA 32.768KHz EXS00A-MU00525 (EXS10B-21238); Order_Code_Digikey: 644-1386

## Sheet MCU_144_POWER.SchDoc: MCU 144 POWER
size Tabloid; Date: Not used; ApprovedBy: Not used; CheckedBy: Not used; Author: Not used; CompanyName: STMicroelectronics; DrawnBy: Not used; Engineer: Not used; Organization: Not used; Address1: Not used; Address2: Not used; Address3: Not used; Address4: Not used; DocumentNumber: 4; Revision: Not used; SheetNumber: 4; SheetTotal: 9; CurrentTime: Not used; CurrentDate: Not used; Time: Not used; DocumentFullPathAndName: Not used; DocumentName: Not used; ModifiedDate: Not used; ImagePath: Not used; ProjectName: Not used; Application_BuildNumber: Not used
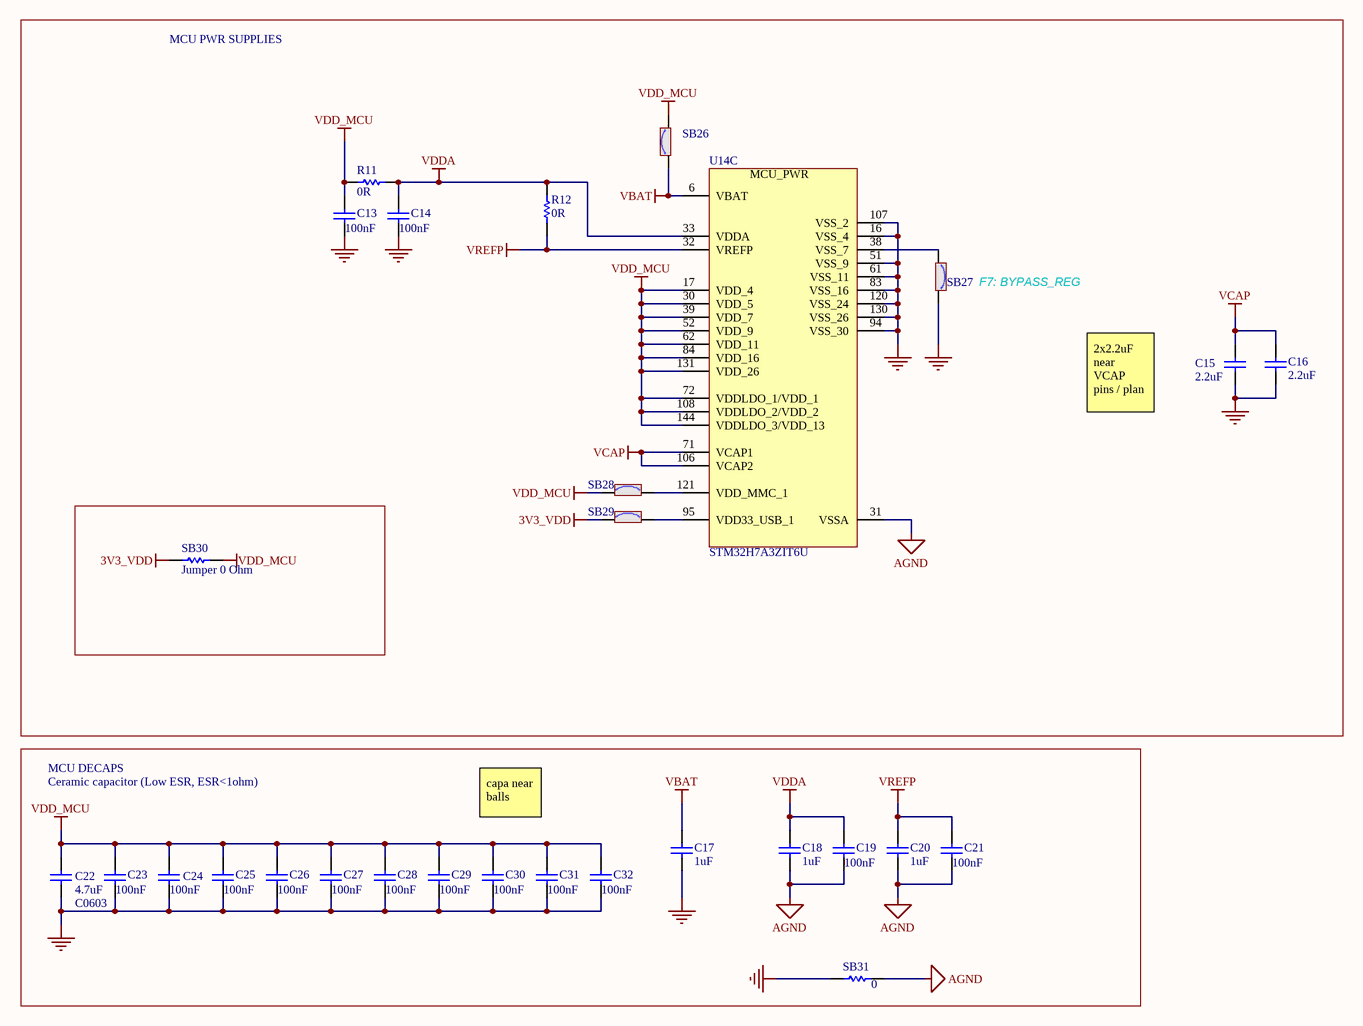
[diagram p5: MCU_144_POWER.SchDoc]

### Parts
C13  Capacitance: 100nF  [C0402]  (hidden comment: Capacitor)
C14  Capacitance: 100nF  [C0402]  (hidden comment: Capacitor)
C15  value 2.2uF  [C0603]  (hidden comment: Capacitor)
C16  value 2.2uF  [C0603]  (hidden comment: Capacitor)
C17  value 1uF  [C0603]  (hidden comment: Capacitor)
C18  value 1uF  [C0603]  (hidden comment: Capacitor)
C19  Capacitance: 100nF  [C0402]  (hidden comment: Capacitor)
C20  value 1uF  [C0603]  (hidden comment: Capacitor)
C21  Capacitance: 100nF  [C0402]  (hidden comment: Capacitor)
C22  value 4.7uF  [C0603]  (hidden comment: Capacitor)
C23  Capacitance: 100nF  [C0402]  (hidden comment: Capacitor)
C24  Capacitance: 100nF  [C0402]  (hidden comment: Capacitor)
C25  Capacitance: 100nF  [C0402]  (hidden comment: Capacitor)
C26  Capacitance: 100nF  [C0402]  (hidden comment: Capacitor)
C27  Capacitance: 100nF  [C0402]  (hidden comment: Capacitor)
C28  Capacitance: 100nF  [C0402]  (hidden comment: Capacitor)
C29  Capacitance: 100nF  [C0402]  (hidden comment: Capacitor)
C30  Capacitance: 100nF  [C0402]  (hidden comment: Capacitor)
C31  Capacitance: 100nF  [C0402]  (hidden comment: Capacitor)
C32  Capacitance: 100nF  [C0402]  (hidden comment: Capacitor)
R11  value 0R  [R0603]  (hidden comment: Resistor)
R12  value 0R  [R0603]  (hidden comment: Resistor)
SB26  SB_ON  [SOLDER-BRIDGE_R0603-0R]  (value not drawn)
SB27  SB_ON  [SOLDER-BRIDGE_R0603-0R]  (value not drawn)
SB28  SB_ON  [SOLDER-BRIDGE_R0603-0R]  (value not drawn)
SB29  SB_ON  [SOLDER-BRIDGE_R0603-0R]  (value not drawn)
SB30  Jumper 0 Ohm  [RESC1608X55X25ML10T15]
SB31  0  [RESC1608X55X25ML10T15]
U14  value STM32H7A3ZIT6U  [ICC_LQFP144_20X20_P050_SOCKET_YAMAICHI_IC149-144-145-B5_NM]  (hidden comment: STM32H7A3ZIT6)  (part C of 3)

### Nets
3V3_VDD: SB29.1 SB30.1
AGND: C18.2 C19.1 C20.2 C21.1 SB31.2 U14.31(VSSA)
GND: C13.1 C14.1 C15.1 C16.1 C17.1 C22.1 C23.1 C24.1 C25.1 C26.1 C27.1 C28.1 C29.1 C30.1 C31.1 C32.1 SB27.2 SB31.1 U14.16(VSS_4) U14.51(VSS_9) U14.61(VSS_11) U14.83(VSS_16) U14.94(VSS_30) U14.107(VSS_2) U14.120(VSS_24) U14.130(VSS_26)
VBAT: C17.2 SB26.1 U14.6(VBAT)
VCAP: C15.2 C16.2 U14.71(VCAP1) U14.106(VCAP2)
VDD_MCU: C13.2 C22.2 C23.2 C24.2 C25.2 C26.2 C27.2 C28.2 C29.2 C30.2 C31.2 C32.2 R11.1 SB26.2 SB28.1 SB30.2 U14.17(VDD_4) U14.30(VDD_5) U14.39(VDD_7) U14.52(VDD_9) U14.62(VDD_11) U14.72(VDDLDO_1/VDD_1) U14.84(VDD_16) U14.108(VDDLDO_2/VDD_2) U14.131(VDD_26) U14.144(VDDLDO_3/VDD_13)
VDDA: C14.2 C18.1 C19.2 R11.2 R12.1 U14.33(VDDA)
VREFP: C20.1 C21.2 R12.2 U14.32(VREFP)
NetSB27_1: SB27.1 U14.38(VSS_7)
NetSB28_2: SB28.2 U14.121(VDD_MMC_1)
NetSB29_2: SB29.2 U14.95(VDD33_USB_1)

### Notes on the sheet
- MCU PWR SUPPLIES
- (near SB27) F7: BYPASS_REG
- 2x2.2uF near VCAP pins / plan
- MCU DECAPS
- Ceramic capacitor (Low ESR, ESR<1ohm)
- capa near balls
- Title
- Size:
- Date:
- Tabloid
- Number:
- Time:
- Revision:
- Sheet
- of
- ZLS Corporation
- 7801 North Lamar Blvd.
- Suite E-184
- Austin, Texas 78752  USA
- (512) 453-0288
- File:
- (in symbol MCD-01349, part C) MCU_PWR

### Library data of the parts
C13 C14 C19 C21 C23-C32 = MCD-01123: as C1 on sheet Connectors; Supplier 1: Mouser; Supplier Part Number 1: 603-CC402KRX7R7BB104; Stock 1: 164534511; Pricing 1: 1=0.10000, 10=0.02700, 50=0.02700, 100=0.01200, 1000=0.00700, 2500=0.00600, 10000=0.00500, 20000=0.00400 (USD); RoHS: Yes; Mount: Surface Mount; Case/Package: 0402; Number of Pins: 2; Case Code (Metric): 1005; Case Code (Imperial): 0402; Min Operating Temperature: -55°C; Max Operating Temperature: 125°C; Dielectric: X7R; Voltage Rating: 16V; Voltage Rating (DC): 16V; Packaging: Tape and Reel; Package Quantity: 1; Termination: SMD/SMT; Composition: Ceramic; Voltage: 16V; Length: 1mm; Height: 0.5mm; Width: 0.02inch; Thickness: 0.022inch; Depth: 0.5mm; Radiation Hardening: No; REACH SVHC: No SVHC; Lead Free: Lead Free; Halogen Free: Halogen Free; ComponentLink1URL: https://datasheet.ciiva.com/11788/0900766b80ce67ed-11788364.pdf?src-supplier=RSComponents; ComponentLink1Description: https://datasheet.ciiva.com/11788/0900766b80ce67ed-11788364.pdf?src-supplier=RSComponents; ComponentLink2URL: https://datasheet.ciiva.com/16625/upy-gphc-x7r-6-3v-to-50v-8-16625511.pdf?src-supplier=Avnet+Europe; ComponentLink2Description: https://datasheet.ciiva.com/16625/upy-gphc-x7r-6-3v-to-50v-8-16625511.pdf?src-supplier=Avnet+Europe; ComponentLink3URL: https://datasheet.ciiva.com/161/mlccorderingcode-161544.pdf?src-supplier=Digi-Key; ComponentLink3Description: https://datasheet.ciiva.com/161/mlccorderingcode-161544.pdf?src-supplier=Digi-Key; ComponentLink4URL: https://datasheet.ciiva.com/11587/upy-gphc-x7r-6-3v-to-50v-8-11587305.pdf?src-supplier=Avnet; ComponentLink4Description: https://datasheet.ciiva.com/11587/upy-gphc-x7r-6-3v-to-50v-8-11587305.pdf?src-supplier=Avnet; ComponentLink5URL: https://datasheet.ciiva.com/161/mlccorderingcode-161546.pdf?src-supplier=Digi-Key; ComponentLink5Description: https://datasheet.ciiva.com/161/mlccorderingcode-161546.pdf?src-supplier=Digi-Key; ComponentLink6URL: https://datasheet.ciiva.com/7978/1489800-7978111.pdf?src-supplier=Element14; ComponentLink6Description: https://datasheet.ciiva.com/7978/1489800-7978111.pdf?src-supplier=Element14; ComponentLink7URL: https://datasheet.ciiva.com/161/mlccorderingcode-161545.pdf?src-supplier=Digi-Key; ComponentLink7Description: https://datasheet.ciiva.com/161/mlccorderingcode-161545.pdf?src-supplier=Digi-Key; ComponentLink8URL: https://datasheet.ciiva.com/13395/upy-gphc-x7r-6-3v-to-50v-8-13395676.pdf?src-supplier=Mouser; ComponentLink8Description: https://datasheet.ciiva.com/13395/upy-gphc-x7r-6-3v-to-50v-8-13395676.pdf?src-supplier=Mouser; ComponentLink9URL: https://datasheet.ciiva.com/8033/1734573-8033661.pdf?src-supplier=Element14; ComponentLink9Description: https://datasheet.ciiva.com/8033/1734573-8033661.pdf?src-supplier=Element14; ComponentLink10URL: https://datasheet.ciiva.com/8033/1734573-8033663.pdf?src-supplier=Element14; ComponentLink10Description: https://datasheet.ciiva.com/8033/1734573-8033663.pdf?src-supplier=Element14; ComponentLink11URL: https://datasheet.ciiva.com/28450/1489800-28450335.pdf?src-supplier=Element14; ComponentLink11Description: https://datasheet.ciiva.com/28450/1489800-28450335.pdf?src-supplier=Element14
C15 C16 = MCD-00012: Capacitor, MLCC, 2.2uF, 10V, X5R, 10%, 0603, T=0,8mm; Manufacturer_Part_Number: CC0603KRX5R6BB225; Manufacturer: YAGEO; Alternate_Manufacturer_Part_Number: C0603C225K8PACTU; Alternate_Manufacturer: KEMET; Provided_By: SUBCO; ECCN_US: EAR99; ECCN_EU: NEC; Internal_Part_Number: MCD-00012; Status: Released; Part_Type: Capacitor; Package: C0603; ComponentLink1Description: Datasheet; ComponentLink1URL: http://tunmcdsvn.tun.st.com/Component_Datasheet_Library/Trunk/Capacitors/Yageo_Multilayer_capacitor_X5R_series_100pF_to_100uF
C17 C18 C20 = MCD-00238: Capacitor, MLCC, 1uF, 6V3, X5R, 10%, 0603, T=0,8mm; Manufacturer_Part_Number: CC0603KRX5R5BB105; Manufacturer: YAGEO; Provided_By: SUBCO; ECCN_US: EAR99; ECCN_EU: NEC; Internal_Part_Number: MCD-00238; Status: Released; Part_Type: Capacitor; Package: C0603; ComponentLink1Description: Datasheet; ComponentLink1URL: http://tunmcdsvn.tun.st.com/Component_Datasheet_Library/Trunk/Capacitors/Yageo_Multilayer_capacitor_X5R_series_100pF_to_100uF
C22 = MCD-01121: as C4 on sheet Power_Board; Internal_Part_Number: MCD-01121; Status: Released; Part_Type: Capacitor; Package: C0603; ComponentLink1Description: Datasheet; ComponentLink1URL: http://tunmcdsvn.tun.st.com/Component_Datasheet_Library/Trunk/Capacitors/Murata_Capacitor_GR_series
R11 R12 = MCD-00056: Resistor,0R,0603,5%,1/10W; Manufacturer_Part_Number: RC0603JR-070RL; Manufacturer: YAGEO; Provided_By: SUBCO; ECCN_US: EAR99; ECCN_EU: NEC; Internal_Part_Number: MCD-00056; ComponentLink1Description: Datasheet; Status: Released; Part_Type: Resistor; ComponentLink1URL: http://tunmcdsvn.tun.st.com/Component_Datasheet_Library/Trunk/Resistors/Yageo_Resistor_RC0603-series; Package: R0603
SB26-SB29 = MCD-00071: as SB1 on sheet Connectors; Internal_Part_Number: MCD-00071; Status: Released; ComponentLink1Description: Datasheet; Package: SB0603; ComponentLink1URL: http://tunmcdsvn.tun.st.com/Component_Datasheet_Library/Trunk/Resistors/Yageo_Resistor_RC0603-series; ECCN_US: n/a; ECCN_EU: n/a
SB30 SB31 = CMP-2100-03667-1: Chip Resistor, 0 Ohm, +/- 5%, 0.1 W, -55 to 155 degC, 0603 (1608 Metric), RoHS, Tape and Reel; Manufacturer: Yageo; Manufacturer Part Number: RC0603JR-070RL; Temperature Coefficient: 200ppm/degreesC; Voltage Rating: 50V; Power Rating: 100mW; Resistance: 0mOhm; Width: 0.8mm; Max Operating Temperature: 155degC; Tolerance: 5%; Package Reference: 0603; Height: 0.45mm; Depth: 0.8mm; Package Description: 2-Pin Surface Mount Device, Body 1.6 x 0.8 mm; Termination: SMD/SMT; Package Quantity: 5000; Case/Package: 0603; Case Code (Imperial): 0603; Radiation Hardening: No; Number of Pins: 2; Length: 1.6mm; Lead Free: LeadFree; Voltage Rating (DC): 50V; Military Standard: Not; Datasheet URL: http://www.yageo.com/NewPortal/yageodocoutput?fileName=/pdf/R-Chip/PYu-RC_Group_51_RoHS_L_5.pdf; Manufacturer URL: http://www.yageo.com/; Packaging: TapeandReel; Case Code (Metric): 1608; Min Operating Temperature: -55degC; Composition: ThickFilm; RoHSCompliant: true; Contact Plating: Tin; Datasheet Version: Rev. 5, 10/2016; REACH SVHC: NoSVHC; Supplier 1: Digi-Key; Supplier Part Number 1: 311-0.0GRCT-ND; Stock 1: 41068279; Pricing 1: 1=0.10000, 10=0.02200, 25=0.01560, 50=0.01200, 100=0.00880, 250=0.00672, 500=0.00538, 1000=0.00396 (USD); RoHS: Yes; ComponentLink1URL: https://datasheet.ciiva.com/11808/pyu-r-int-6-11808700.pdf?src-supplier=RSComponents; ComponentLink1Description: https://datasheet.ciiva.com/11808/pyu-r-int-6-11808700.pdf?src-supplier=RSComponents; ComponentLink2URL: https://datasheet.ciiva.com/7746/1738695-7746421.pdf?src-supplier=Element14; ComponentLink2Description: https://datasheet.ciiva.com/7746/1738695-7746421.pdf?src-supplier=Element14; ComponentLink3URL: https://datasheet.ciiva.com/8883/pyu-rc0603-51-rohs-l-4-8883045.pdf?src-supplier=Avnet; ComponentLink3Description: https://datasheet.ciiva.com/8883/pyu-rc0603-51-rohs-l-4-8883045.pdf?src-supplier=Avnet; ComponentLink4URL: https://datasheet.ciiva.com/15189/getdatasheetpartid-329462-15189845.pdf?src-supplier=Verical; ComponentLink4Description: https://datasheet.ciiva.com/15189/getdatasheetpartid-329462-15189845.pdf?src-supplier=Verical; ComponentLink5URL: https://datasheet.ciiva.com/7746/1738695-7746422.pdf?src-supplier=Element14; ComponentLink5Description: https://datasheet.ciiva.com/7746/1738695-7746422.pdf?src-supplier=Element14; ComponentLink6URL: https://datasheet.ciiva.com/12555/rc0603-272842-12555254.pdf?src-supplier=Mouser; ComponentLink6Description: https://datasheet.ciiva.com/12555/rc0603-272842-12555254.pdf?src-supplier=Mouser; ComponentLink7URL: https://datasheet.ciiva.com/22747/443971-22747530.pdf?src-supplier=Element14; ComponentLink7Description: https://datasheet.ciiva.com/22747/443971-22747530.pdf?src-supplier=Element14
U14 = MCD-01349: STM32H7A3ZIT6U, LQFP144 package, 20x20; Part_Type: IC; Manufacturer: STMICROELECTRONICS; BMS_Part_Number: 9175347; Provided_By: SUBCO with ST control; ECCN_US: 3A991A2; ECCN_EU: NEC; Internal_Part_Number: MCD-01349; Status: Released; Manufacturer_Part_Number: STM32H7A3ZIT6U; Package: LQFP144; ComponentLink1Description: Datasheet; ComponentLink1URL: http://tunmcdsvn.tun.st.com/Component_Datasheet_Library/Trunk/IC/STM_STM32L552ZET6QU

## Sheet ST_LINK_V3E.SchDoc: STLINK_V3E
size OrCAD A; Date: Not used; ApprovedBy: Not used; CheckedBy: Not used; Author: Not used; CompanyName: STMicroelectronics; DrawnBy: Not used; Engineer: Not used; Organization: Not used; Address1: Not used; Address2: Not used; Address3: Not used; Address4: Not used; DocumentNumber: 10; Revision: Not used; SheetNumber: 9; SheetTotal: 9; CurrentTime: Not used; CurrentDate: Not used; Time: Not used; DocumentFullPathAndName: Not used; DocumentName: Not used; ModifiedDate: Not used; ImagePath: Not used; ProjectName: Not used; Application_BuildNumber: Not used
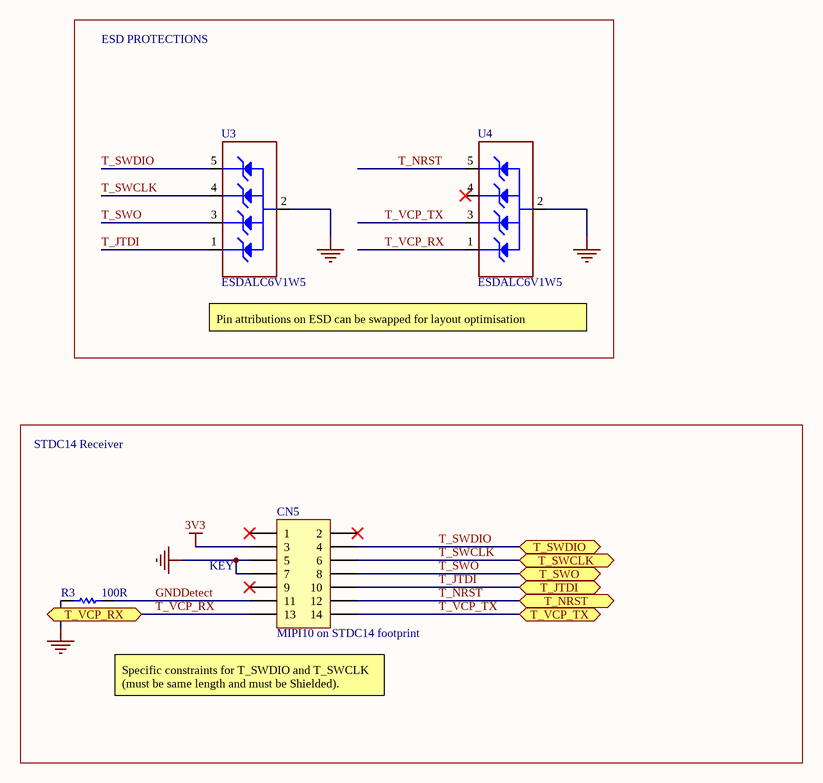
[diagram p6: ST_LINK_V3E.SchDoc]

### Parts
CN5  value MIPI10 on STDC14 footprint  [CON_STDC14_Receiver_MEDIUM_WITH_MIPI10_3D]  (hidden comment: Header 7x2)
R3  value 100R  [R0402]  (hidden comment: Resistor)
U3  ESDALC6V1W5  [ESD_SOT323-5L]
U4  ESDALC6V1W5  [ESD_SOT323-5L]

### Blocks framed on the sheet
ESD PROTECTIONS: U3 U4

### Ports
T_JTDI (bidir), T_NRST, T_SWCLK, T_SWDIO, T_SWO, T_VCP_RX, T_VCP_TX

### Nets
3V3: CN5.3
GND: CN5.5 CN5.7 R3.1 U3.2(GND) U4.2(GND)
GNDDetect: CN5.11 R3.2
T_JTDI: CN5.10 U3.1(IO1) ; port T_JTDI  [project net PA15]
T_NRST: CN5.12 U4.5(IO4) ; port T_NRST
T_SWCLK: CN5.6 U3.4(IO3) ; port T_SWCLK
T_SWDIO: CN5.4 U3.5(IO4) ; port T_SWDIO
T_SWO: CN5.8 U3.3(IO2) ; port T_SWO
T_VCP_RX: CN5.13 U4.1(IO1) ; port T_VCP_RX
T_VCP_TX: CN5.14 U4.3(IO2) ; port T_VCP_TX

Not connected (* = marked no-connect by the designer): CN5 1* 2* 9*; U4 4(IO3)*

### Notes on the sheet
- Pin attributions on ESD can be swapped for layout optimisation
- STDC14 Receiver
- (near CN5) KEY
- Specific constraints for T_SWDIO and T_SWCLK (must be same length and must be Shielded).
- Title
- Size:
- Date:
- Orcad A
- Number:
- Time:
- Revision:
- Sheet
- of
- ZLS Corporation
- 7801 North Lamar Blvd.
- Suite E-184
- Austin, Texas 78752  USA
- (512) 453-0288
- File:

### Library data of the parts
CN5 = MCD-01226: Header 5x2, 1.27mm, Dual row, Straight, Surface mount, vertical male connector. 3.05mm lead. Mates with FFSD connector. Footprint compatible with FTSH-107-01-L-DV,-K,-A,-P,-ES (STDC14 MEDIUM); Manufacturer_Part_Number: FTSH-105-01-L-DV-K; Manufacturer: SAMTEC; Alternate_Manufacturer_Part_Number: P127B-2x05MGF-079-1A; Alternate_Manufacturer: JIUBABA; Provided_By: SUBCO; Internal_Part_Number: MCD-01226; Status: Released; Part_Type: Connector; ComponentLink1Description: Datasheet; ComponentLink1URL: http://tunmcdsvn.tun.st.com/Component_Datasheet_Library/Trunk/Connectors/Samtec_FTSH_smt_series; ECCN_US: n/a; ECCN_EU: n/a
R3 = MCD-00119: Resistor,100R,0402,1%,1/16W; Manufacturer_Part_Number: RC0402FR-07100RL; Manufacturer: YAGEO; Provided_By: SUBCO; ECCN_US: EAR99; ECCN_EU: NEC; Internal_Part_Number: MCD-00119; Status: Released; Part_Type: Resistor; ComponentLink1Description: Datasheet; Package: R0402; ComponentLink1URL: http://tunmcdsvn.tun.st.com/Component_Datasheet_Library/Trunk/Resistors/Yageo_Resistor_RC0402-series
U3 U4 = MCD-00136: Dual Transil array for ESD protection; Part_Type: Diode; Manufacturer: STMICROELECTRONICS; BMS_Part_Number: 9151112; Provided_By: SUBCO with ST control; ECCN_US: EAR99; ECCN_EU: NEC; Internal_Part_Number: MCD-00136; Value: ESDALC6V1W5; Status: Released; Manufacturer_Part_Number: ESDALC6V1W5; ComponentLink1Description: Datasheet; ComponentLink1URL: http://tunmcdsvn.tun.st.com/Component_Datasheet_Library/Trunk/Diodes/STM_ESD_ESDALC6V1W5